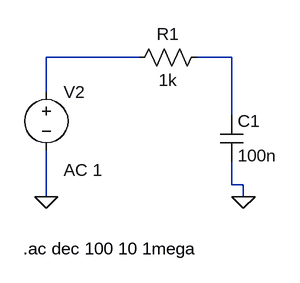
[diagram p0: schematic Draft3.asc]
Draft3.asc, the LTspice schematic file:
Version 4
SHEET 1 880 680
WIRE 224 16 96 16
WIRE 352 16 304 16
WIRE 96 64 96 16
WIRE 352 96 352 16
WIRE 352 192 352 160
WIRE 368 192 352 192
WIRE 96 208 96 144
WIRE 368 208 368 192
FLAG 96 208 0
FLAG 368 208 0
SYMBOL voltage 96 48 R0
WINDOW 123 24 124 Left 2
WINDOW 39 0 0 Left 0
SYMATTR InstName V2
SYMATTR Value ""
SYMATTR Value2 AC 1
SYMBOL res 320 0 R90
WINDOW 0 0 56 VBottom 2
WINDOW 3 32 56 VTop 2
SYMATTR InstName R1
SYMATTR Value 1k
SYMBOL cap 336 96 R0
SYMATTR InstName C1
SYMATTR Value 100n
TEXT 64 280 Left 2 !.ac dec 100 10 1mega

The netlist it stands for:
* Draft3.asc
V2 N001 0 AC 1
R1 N002 N001 1k
C1 N002 0 100n
.ac dec 100 10 1mega
.backanno
.end